# EAGLE design BaseBoard (EAGLE 6.5.0)
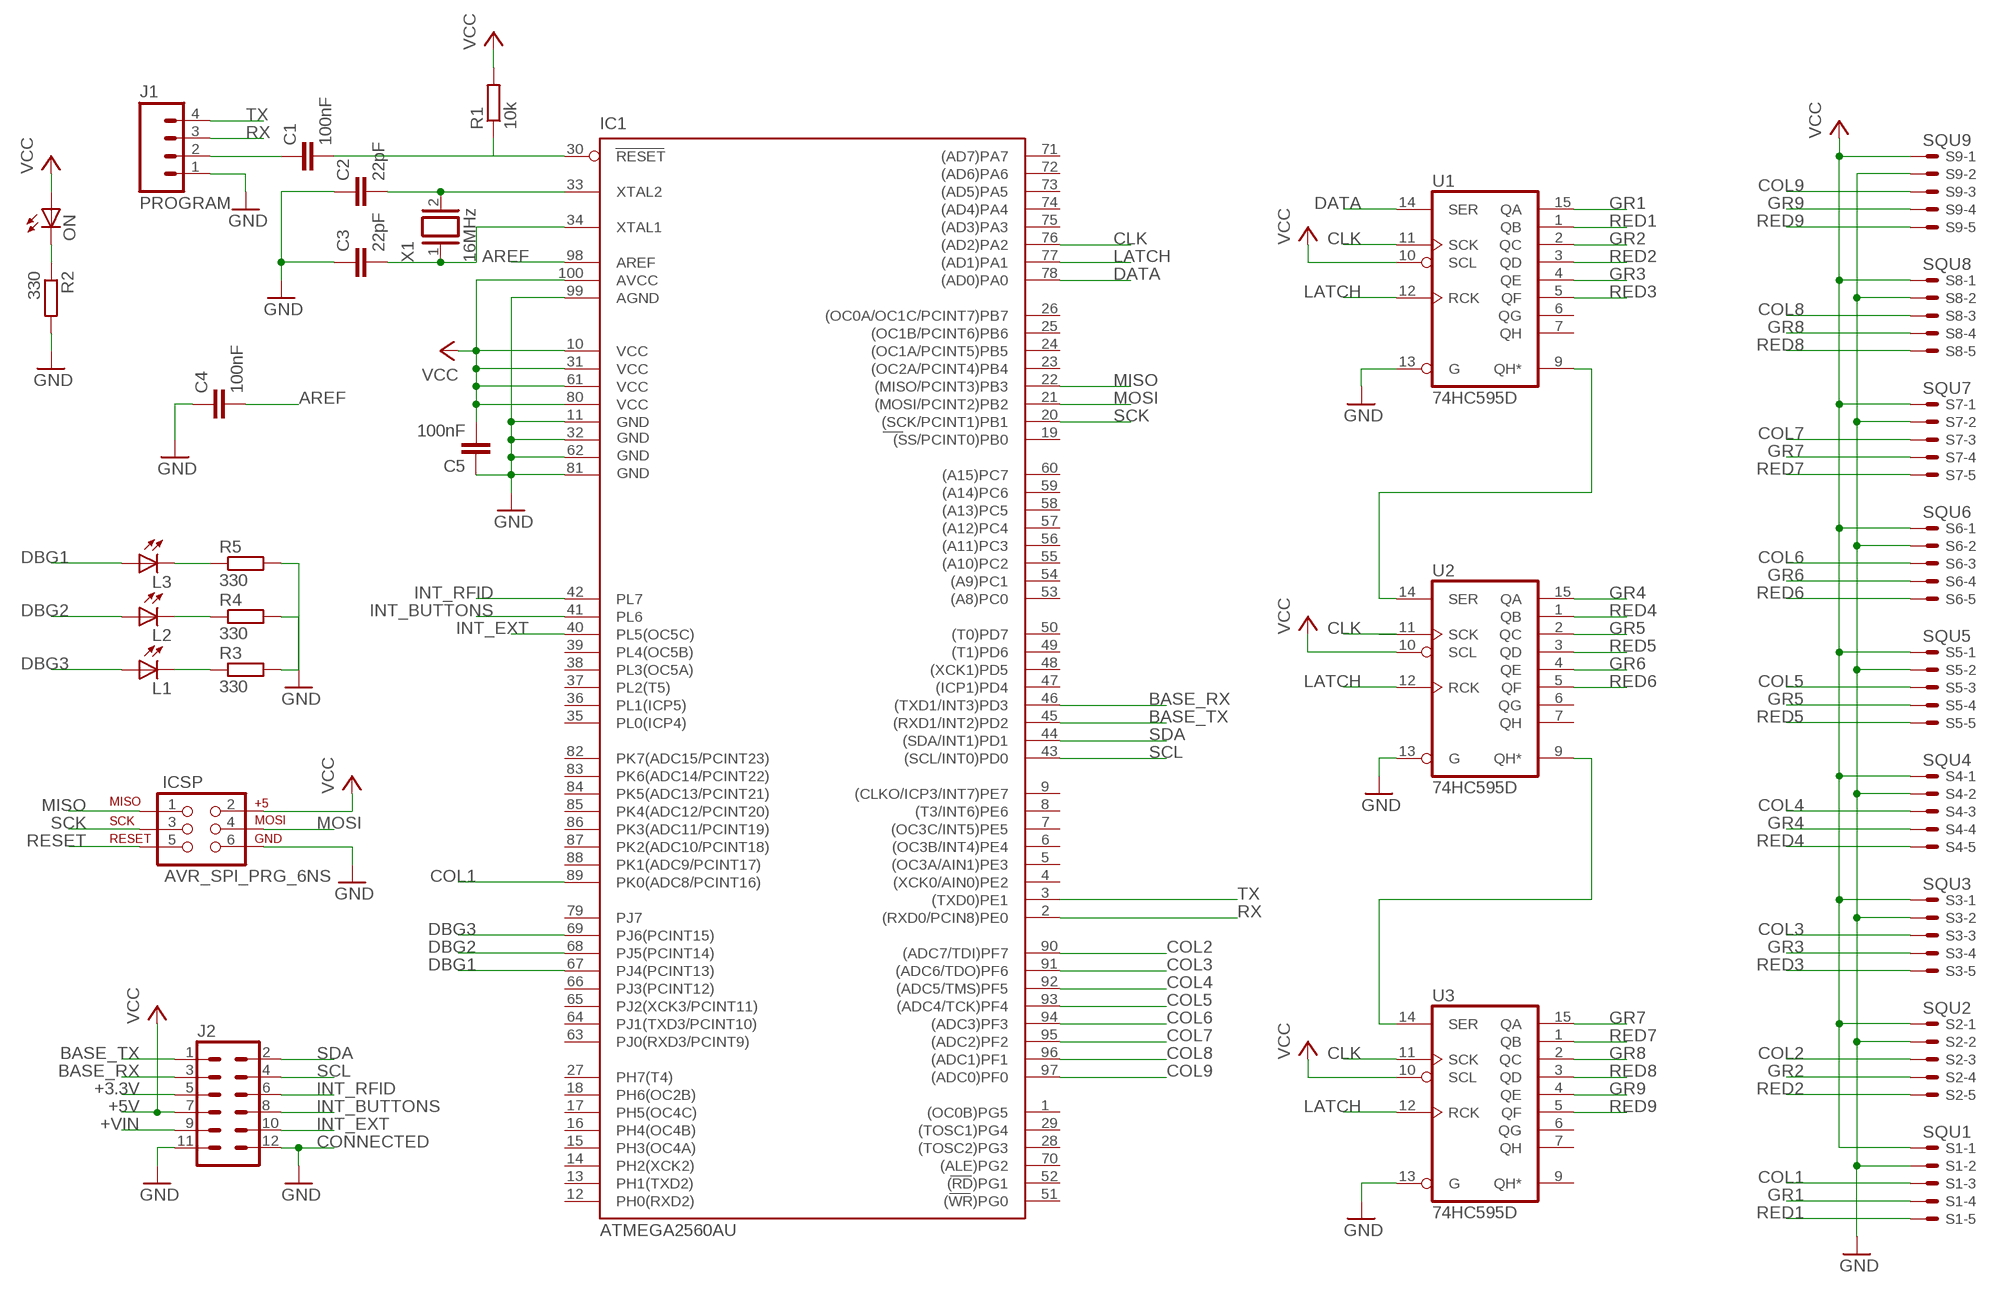
[diagram p0: schematic, sheet 1]

## Parts
C1  100nF  C-EUC0805  [C0805]
C2  22pF  C-EUC0805  [C0805]
C3  22pF  C-EUC0805  [C0805]
C4  100nF  C-EUC0805  [C0805]
C5  100nF  C-EUC0805  [C0805]
IC1  ATMEGA2560AU  [TQFP100]
ICSP  AVR_SPI_PRG_6NS  [2X3-NS]
J1  PROGRAM  M04PTH  [1X04]
J2  CON06X2-2MM  [CON06X2_2MM]
L1  LEDCHIP-LED0805  [CHIP-LED0805]
L2  LEDCHIP-LED0805  [CHIP-LED0805]
L3  LEDCHIP-LED0805  [CHIP-LED0805]
ON  LEDCHIP-LED0805  [CHIP-LED0805]
R1  10k  R-EU_R0805  [R0805]
R2  330  R-EU_R0805  [R0805]
R3  330  R-EU_R0805  [R0805]
R4  330  R-EU_R0805  [R0805]
R5  330  R-EU_R0805  [R0805]
S1  SQU1  53261-05  [53261-05]
S2  SQU2  53261-05  [53261-05]
S3  SQU3  53261-05  [53261-05]
S4  SQU4  53261-05  [53261-05]
S5  SQU5  53261-05  [53261-05]
S6  SQU6  53261-05  [53261-05]
S7  SQU7  53261-05  [53261-05]
S8  SQU8  53261-05  [53261-05]
S9  SQU9  53261-05  [53261-05]
U1  74HC595D  [SO16]
U2  74HC595D  [SO16]
U3  74HC595D  [SO16]
X1  16MHz  XTAL/S  [QS]

## Nets
+3.3V: J2.5
+VIN: J2.9
AREF: C4.2 IC1.98(AREF)
BASE_RX: IC1.46((TXD1/INT3)PD3) J2.3
BASE_TX: IC1.45((RXD1/INT2)PD2) J2.1
CLK: IC1.76((AD2)PA2) U1.11(SCK) U2.11(SCK) U3.11(SCK)
COL1: IC1.89(PK0(ADC8/PCINT16)) S1.3
COL2: IC1.90((ADC7/TDI)PF7) S2.3
COL3: IC1.91((ADC6/TDO)PF6) S3.3
COL4: IC1.92((ADC5/TMS)PF5) S4.3
COL5: IC1.93((ADC4/TCK)PF4) S5.3
COL6: IC1.94((ADC3)PF3) S6.3
COL7: IC1.95((ADC2)PF2) S7.3
COL8: IC1.96((ADC1)PF1) S8.3
COL9: IC1.97((ADC0)PF0) S9.3
DATA: IC1.78((AD0)PA0) U1.14(SER)
DBG1: IC1.67(PJ4(PCINT13)) L3.A
DBG2: IC1.68(PJ5(PCINT14)) L2.A
DBG3: IC1.69(PJ6(PCINT15)) L1.A
GND: C2.1 C3.1 C4.1 C5.1 IC1.11(GND) IC1.32(GND1) IC1.62(GND2) IC1.81(GND3) IC1.99(AGND) ICSP.6 J1.1 J2.11 J2.12 R2.2 R3.2 R4.2 R5.2 S1.2 S2.2 S3.2 S4.2 S5.2 S6.2 S7.2 S8.2 S9.2 U1.13(G) U2.13(G) U3.13(G)
GR1: S1.4 U1.15(QA)
GR2: S2.4 U1.2(QC)
GR3: S3.4 U1.4(QE)
GR4: S4.4 U2.15(QA)
GR5: S5.4 U2.2(QC)
GR6: S6.4 U2.4(QE)
GR7: S7.4 U3.15(QA)
GR8: S8.4 U3.2(QC)
GR9: S9.4 U3.4(QE)
INT_BUTTONS: IC1.41(PL6) J2.8
INT_EXT: IC1.40(PL5(OC5C)) J2.10
INT_RFID: IC1.42(PL7) J2.6
LATCH: IC1.77((AD1)PA1) U1.12(RCK) U2.12(RCK) U3.12(RCK)
MISO: IC1.22((MISO/PCINT3)PB3) ICSP.1
MOSI: IC1.21((MOSI/PCINT2)PB2) ICSP.4
N$1: C2.2 IC1.33(XTAL2) X1.2
N$2: C3.2 IC1.34(XTAL1) X1.1
N$3: L2.C R4.1
N$4: L1.C R3.1
N$5: C1.1 J1.2
N$6: U1.9(QH*) U2.14(SER)
N$7: U2.9(QH*) U3.14(SER)
N$8: ON.C R2.1
N$9: L3.C R5.1
RED1: S1.5 U1.1(QB)
RED2: S2.5 U1.3(QD)
RED3: S3.5 U1.5(QF)
RED4: S4.5 U2.1(QB)
RED5: S5.5 U2.3(QD)
RED6: S6.5 U2.5(QF)
RED7: S7.5 U3.1(QB)
RED8: S8.5 U3.3(QD)
RED9: S9.5 U3.5(QF)
RESET: C1.2 IC1.30(RESET) ICSP.5 R1.1
RX: IC1.2((RXD0/PCIN8)PE0) J1.3
SCK: IC1.20((SCK/PCINT1)PB1) ICSP.3
SCL: IC1.43((SCL/INT0)PD0) J2.4
SDA: IC1.44((SDA/INT1)PD1) J2.2
TX: IC1.3((TXD0)PE1) J1.4
VCC: C5.2 IC1.10(VCC) IC1.31(VCC1) IC1.61(VCC2) IC1.80(VCC3) IC1.100(AVCC) ICSP.2 J2.7 ON.A R1.2 S1.1 S2.1 S3.1 S4.1 S5.1 S6.1 S7.1 S8.1 S9.1 U1.10(SCL) U2.10(SCL) U3.10(SCL)
Unconnected: IC1.1((OC0B)PG5) IC1.4((XCK0/AIN0)PE2) IC1.5((OC3A/AIN1)PE3) IC1.6((OC3B/INT4)PE4) IC1.7((OC3C/INT5)PE5) IC1.8((T3/INT6)PE6) IC1.9((CLKO/ICP3/INT7)PE7) IC1.12(PH0(RXD2)) IC1.13(PH1(TXD2)) IC1.14(PH2(XCK2)) IC1.15(PH3(OC4A)) IC1.16(PH4(OC4B)) IC1.17(PH5(OC4C)) IC1.18(PH6(OC2B)) IC1.19((SS/PCINT0)PB0) IC1.23((OC2A/PCINT4)PB4) IC1.24((OC1A/PCINT5)PB5) IC1.25((OC1B/PCINT6)PB6) IC1.26((OC0A/OC1C/PCINT7)PB7) IC1.27(PH7(T4)) IC1.28((TOSC2)PG3) IC1.29((TOSC1)PG4) IC1.35(PL0(ICP4)) IC1.36(PL1(ICP5)) IC1.37(PL2(T5)) IC1.38(PL3(OC5A)) IC1.39(PL4(OC5B)) IC1.47((ICP1)PD4) IC1.48((XCK1)PD5) IC1.49((T1)PD6) IC1.50((T0)PD7) IC1.51((WR)PG0) IC1.52((RD)PG1) IC1.53((A8)PC0) IC1.54((A9)PC1) IC1.55((A10)PC2) IC1.56((A11)PC3) IC1.57((A12)PC4) IC1.58((A13)PC5) IC1.59((A14)PC6) IC1.60((A15)PC7) IC1.63(PJ0(RXD3/PCINT9)) IC1.64(PJ1(TXD3/PCINT10)) IC1.65(PJ2(XCK3/PCINT11)) IC1.66(PJ3(PCINT12)) IC1.70((ALE)PG2) IC1.71((AD7)PA7) IC1.72((AD6)PA6) IC1.73((AD5)PA5) IC1.74((AD4)PA4) IC1.75((AD3)PA3) IC1.79(PJ7) IC1.82(PK7(ADC15/PCINT23)) IC1.83(PK6(ADC14/PCINT22)) IC1.84(PK5(ADC13/PCINT21)) IC1.85(PK4(ADC12/PCINT20)) IC1.86(PK3(ADC11/PCINT19)) IC1.87(PK2(ADC10/PCINT18)) IC1.88(PK1(ADC9/PCINT17)) U1.6(QG) U1.7(QH) U2.6(QG) U2.7(QH) U3.6(QG) U3.7(QH) U3.9(QH*)

## Notes on the sheet
- +5V
- CONNECTED

## Power pins joined to a net without a drawn wire
GND: U1.8(GND) U2.8(GND) U3.8(GND)
VCC: U1.16(VCC) U2.16(VCC) U3.16(VCC)

## Library data of the parts
C1-C5 = resistor:C-EU: CAPACITOR, European symbol
IC1 = SparkFun-DigitalIC:ATMEGA2560: Atmel 100-pin 8-bit uC 64/128/256 Kbytes FLASH 4 Kbytes EEPROM 8 Kbytes SRAM 86 General Purpose I/O pins 12-channels16-bit PWM 4 x Serial USARTs 16-channels 10-bit A/D
ICSP = SparkFun-Connectors:AVR_SPI_PRG_6: AVR ISP 6 Pin This is the reduced ISP connector for AVR programming. Common on Arduino. This footprint will take up less PCB space and can be used with a 10-pin to 6-pin adapter such as SKU: BOB-08508
J1 = SparkFun-Connectors:M04: Header 4 Standard 4-pin 0.1" header. Use with straight break away headers (SKU : PRT-00116), right angle break away headers (PRT-00553), swiss pins (PRT-00743), machine pins (PRT-00117), and female headers (PRT-00115). Molex polarized connector foot print use with SKU : PRT-08231 with associated crimp pins and housings. 1MM SMD Version SKU: PRT-10208
J2 = Connectors:CON06X2-2MM
L1-L3 ON = led:LED: LED OSRAM: - CHIPLED LG R971, LG N971, LY N971, LG Q971, LY Q971, LO R971, LY R971 LH N974, LH R974 LS Q976, LO Q976, LY Q976 LO Q996 - Hyper CHIPLED LW Q18S LB Q993, LB Q99A, LB R99A - SideLED LS A670, LO A670, LY A670, LG A670, LP A670 LB A673, LV A673, LT A673, LW A673 LH A674 LY A675 LS A676, LA A676, LO A676, LY A676, LW A676 LS A679, LY A679, LG A679 - Hyper Micro SIDELED® LS Y876, LA Y876, LO Y876, LY Y876 LT Y87S - SmartLED LW L88C, LW L88S LB L89C, LB L89S, LG L890 LS L89K, LO L89K, LY L89K LS L896, LA L896, LO L896, LY L896 - TOPLED LS T670, LO T670, LY T670, LG T670, LP T670 LSG T670, LSP T670, LSY T670, LOP T670, LYG T670 LG T671, LOG T671, LSG T671 LB T673, LV T673, LT T673, LW T673 LH T674 LS T676, LA T676, LO T676, LY T676, LB T676, LH T676, LSB T676, LW T676 LB T67C, LV T67C, LT T67C, LS T67K, LO T67K, LY T67K, LW E67C LS E67B, LA E67B, LO E67B, LY E67B, LB E67C, LV E67C, LT E67C LW T67C LS T679, LY T679, LG T679 LS T770, LO T770, LY T770, LG T770, LP T770 LB T773, LV T773, LT T773, LW T773 LH T774 LS E675, LA E675, LY E675, LS T675 LS T776, LA T776, LO T776, LY T776, LB T776 LHGB T686 LT T68C, LB T68C - Hyper Mini TOPLED® LB M676 - Mini TOPLED Santana® LG M470 LS M47K, LO M47K, LY M47K Source: http://www.osram.convergy.de LUXEON: - LUMILED® LXK2-PW12-R00, LXK2-PW12-S00, LXK2-PW14-U00, LXK2-PW14-V00 LXK2-PM12-R00, LXK2-PM12-S00, LXK2-PM14-U00 LXK2-PE12-Q00, LXK2-PE12-R00, LXK2-PE12-S00, LXK2-PE14-T00, LXK2-PE14-U00 LXK2-PB12-K00, LXK2-PB12-L00, LXK2-PB12-M00, LXK2-PB14-N00, LXK2-PB14-P00, LXK2-PB14-Q00 LXK2-PR12-L00, LXK2-PR12-M00, LXK2-PR14-Q00, LXK2-PR14-R00 LXK2-PD12-Q00, LXK2-PD12-R00, LXK2-PD12-S00 LXK2-PH12-R00, LXK2-PH12-S00 LXK2-PL12-P00, LXK2-PL12-Q00, LXK2-PL12-R00 Source: www.luxeon.com KINGBRIGHT: KA-3528ASYC Source: www.kingbright.com
R1-R5 = resistor:R-EU_: RESISTOR, European symbol
S1-S9 = con-molex:53?-05: CONNECTOR wire to board 1.25 mm (.049 inch) pitch header; OC_FARNELL: 1433644; OC_NEWARK: unknown
U1-U3 = 74xx-eu:74*595: 8-bit SHIFT REGISTER, output latch
X1 = special:XTAL/S: CRYSTAL

## Board
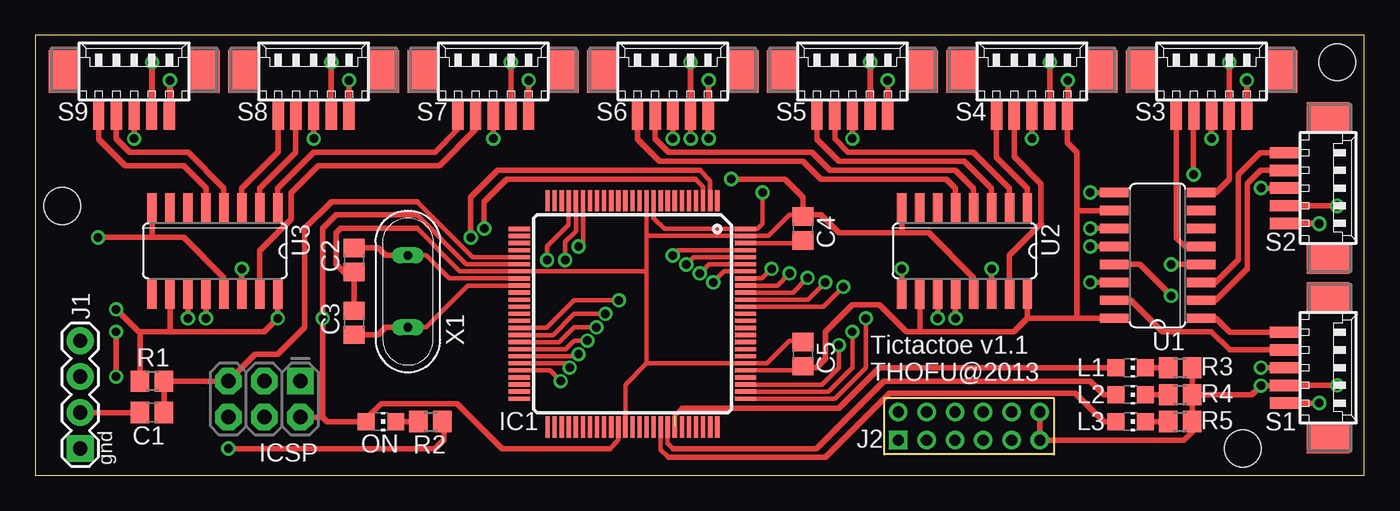
[diagram p1: board, top side]
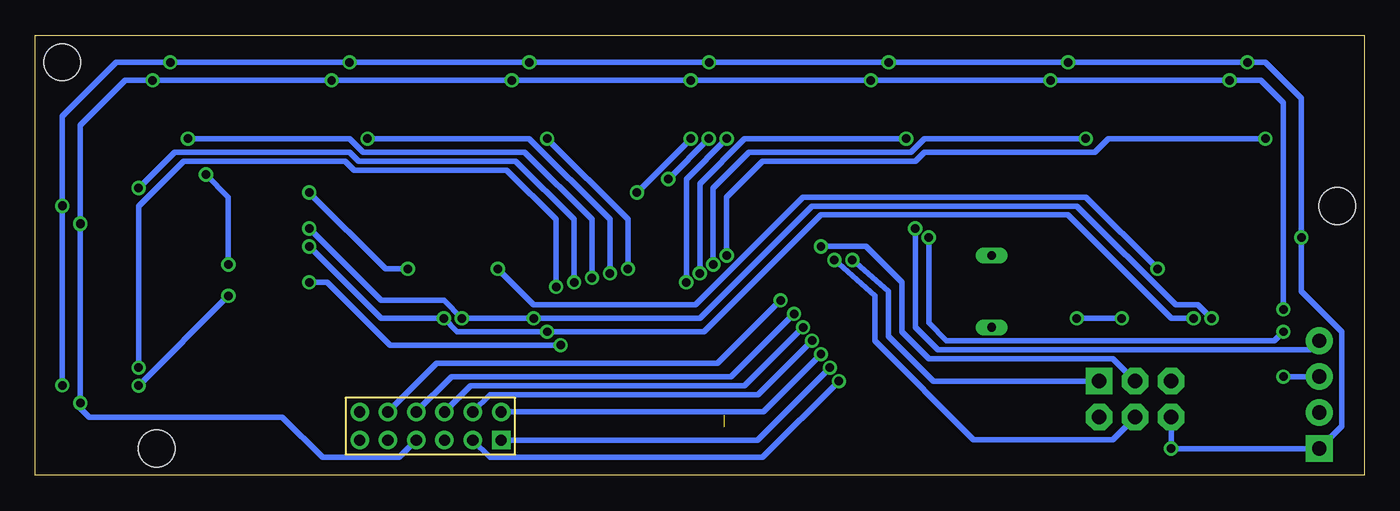
[diagram p2: board, bottom side, seen from below]

Size 93.98 x 31.11 mm. Coordinates in mm from the lower left corner, seen from the top.
Outline: 0,0 93.98,0 93.98,31.11 0,31.11 0,0
Copper layers (1*16): Top 0.035mm / dielectric 1.5mm / Bottom 0.035mm
Design rules "default": minimum track width 10mil, minimum drill 24mil, track to track 8mil, track to pad 8mil, pad to pad 8mil, via to via 8mil, smd to smd 8mil, copper to edge 40mil, drill to drill 8mil, minimum pad ring 10mil, minimum via ring 8mil, stop-mask expansion 4mil, vias tented up to drill 0mil, thermal gap 10mil
Holes 2.6 mm at 92.08,29.21 1.91,19.05 85.41,1.91

### Footprints (pad centres in the part's own frame; a part is rotated, then mirrored left to right if it is on the bottom)
C0805 = smd 1.3 x 1.5: 1 -0.85,0; 2 0.85,0
TQFP100 = smd 1.5 x 0.3: 1 -8,6; 2 -8,5.5; 3 -8,5; 4 -8,4.5; 5 -8,4; 6 -8,3.5; 7 -8,3; 8 -8,2.5; 9 -8,2; 10 -8,1.5; 11 -8,1; 12 -8,0.5; 13 -8,0; 14 -8,-0.5; 15 -8,-1; 16 -8,-1.5; 17 -8,-2; 18 -8,-2.5; 19 -8,-3; 20 -8,-3.5; 21 -8,-4; 22 -8,-4.5; 23 -8,-5; 24 -8,-5.5; 25 -8,-6; 51 8,-6; 52 8,-5.5; 53 8,-5; 54 8,-4.5; 55 8,-4; 56 8,-3.5; 57 8,-3; 58 8,-2.5; 59 8,-2; 60 8,-1.5; 61 8,-1; 62 8,-0.5; 63 8,0; 64 8,0.5; 65 8,1; 66 8,1.5; 67 8,2; 68 8,2.5; 69 8,3; 70 8,3.5; 71 8,4; 72 8,4.5; 73 8,5; 74 8,5.5; 75 8,6 | smd 0.3 x 1.5: 26 -6,-8; 27 -5.5,-8; 28 -5,-8; 29 -4.5,-8; 30 -4,-8; 31 -3.5,-8; 32 -3,-8; 33 -2.5,-8; 34 -2,-8; 35 -1.5,-8; 36 -1,-8; 37 -0.5,-8; 38 0,-8; 39 0.5,-8; 40 1,-8; 41 1.5,-8; 42 2,-8; 43 2.5,-8; 44 3,-8; 45 3.5,-8; 46 4,-8; 47 4.5,-8; 48 5,-8; 49 5.5,-8; 50 6,-8; 76 6,8; 77 5.5,8; 78 5,8; 79 4.5,8; 80 4,8; 81 3.5,8; 82 3,8; 83 2.5,8; 84 2,8; 85 1.5,8; 86 1,8; 87 0.5,8; 88 0,8; 89 -0.5,8; 90 -1,8; 91 -1.5,8; 92 -2,8; 93 -2.5,8; 94 -3,8; 95 -3.5,8; 96 -4,8; 97 -4.5,8; 98 -5,8; 99 -5.5,8; 100 -6,8
2X3-NS = drill 1.016 pad 1.88 square: 1 -2.54,-1.27 | drill 1.016 pad 1.88 octagon: 2 -2.54,1.27; 3 0,-1.27; 4 0,1.27; 5 2.54,-1.27; 6 2.54,1.27
1X04 = drill 1.016 pad 1.88 square: 1 0,0 | drill 1.016 pad 1.88: 2 2.54,0; 3 5.08,0; 4 7.62,0
CON06X2_2MM = drill 0.8 square: 1 -5,-1 | drill 0.8: 2 -5,1; 3 -3,-1; 4 -3,1; 5 -1,-1; 6 -1,1; 7 1,-1; 8 1,1; 9 3,-1; 10 3,1; 11 5,-1; 12 5,1
CHIP-LED0805 = smd 1.2 x 1.2: A 0,-1.05; C 0,1.05
R0805 = smd 1.3 x 1.5: 1 -0.85,0; 2 0.85,0
53261-05 = smd 0.8 x 2: 1 2.5,-2.5; 2 1.25,-2.5; 3 0,-2.5; 4 -1.25,-2.5; 5 -2.5,-2.5 | smd 2.1 x 3: S1 5,0.625; S2 -5,0.625
SO16 = smd 0.66 x 2.032: 1 -4.445,-3.073; 2 -3.175,-3.073; 3 -1.905,-3.073; 4 -0.635,-3.073; 5 0.635,-3.073; 6 1.905,-3.073; 7 3.175,-3.073; 8 4.445,-3.073; 9 4.445,3.073; 10 3.175,3.073; 11 1.905,3.073; 12 0.635,3.073; 13 -0.635,3.073; 14 -1.905,3.073; 15 -3.175,3.073; 16 -4.445,3.073
QS = drill 0.61 long: 1 -2.54,0; 2 2.54,0

### Placement (x,y rotation side)
C1  8.26,4.45 0 top
C2  22.54,15.24 90 top
C3  22.54,10.79 270 top
C4  54.29,17.46 270 top
C5  54.29,8.57 270 top
IC1  42.23,11.43 270 top
ICSP  16.19,5.4 180 top
J1  3.17,1.91 90 top
J2  66.04,3.49 0 top
L1  77.47,7.62 270 top
L2  77.47,5.71 270 top
L3  77.47,3.81 270 top
ON  24.45,3.81 270 top
R1  8.26,6.67 180 top
R2  27.94,3.81 0 top
R3  80.96,7.62 0 top
R4  80.96,5.71 0 top
R5  80.96,3.81 0 top
S1  90.81,7.62 270 top
S2  90.81,20.32 270 top
S3  83.19,27.94 0 top
S4  70.48,27.94 0 top
S5  57.78,27.94 0 top
S6  45.09,27.94 0 top
S7  32.38,27.94 0 top
S8  19.68,27.94 0 top
S9  6.99,27.94 0 top
U1  79.38,15.56 90 top
U2  65.72,15.88 180 top
U3  12.7,15.88 180 top
X1  26.35,13.02 90 top

### Tracks (layer width: path | path; a pad name or v marks a point on that pad's centre or on a via)
AREF
  Top 0.305: IC1.98 54.11,16.43 C4.2
  Top 0.406: 54.16,16.43 C4.2
BASE_RX  (via drill 0.6)
  Top 0.305: v37.15,6.67 36.38,7.43 IC1.46
  Bottom 0.406: v37.15,6.67 42.55,1.27 59.37,1.27 61.82,1.27 J2.3
BASE_TX  (via drill 0.6)
  Top 0.305: IC1.45 37.47,7.93 v37.78,7.62
  Bottom 0.406: v37.78,7.62 42.91,2.49 J2.1
CLK  (via drill 0.6)
  Top 0.305: IC1.76 56.55,5.43 58.74,7.62 v58.74,11.11
  Top 0.406: U3.11 v10.79,11.11 | U2.11 v63.82,11.11 | U1.11 v74.61,17.46
  Bottom 0.406: v74.61,17.46 69.53,12.38 65.09,12.38 v63.82,11.11 v58.74,11.11 46.99,11.11 39.05,19.05 20.32,19.05 13.34,12.06 11.75,12.06 v10.79,11.11
COL1  (via drill 0.6)
  Top 0.305: IC1.89 55.74,11.93 v57.15,13.34
  Top 0.406: S1.3 v86.68,7.62
  Bottom 0.406: v57.15,13.34 57.15,18.1 60.64,21.59 71.44,21.59 72.07,22.23 83.5,22.23 86.68,19.05 v86.68,7.62
COL2  (via drill 0.6)
  Top 0.305: IC1.90 54.66,12.43 v55.88,13.65
  Top 0.406: S2.3 v86.68,20.32
  Bottom 0.406: v55.88,13.65 55.88,18.1 60.01,22.23 71.12,22.23 71.75,22.86 84.14,22.86 v86.68,20.32
COL3  (via drill 0.6)
  Top 0.305: IC1.91 53.57,12.93 v54.61,13.97
  Top 0.406: S3.3 v83.19,23.81
  Bottom 0.406: v54.61,13.97 54.61,18.1 59.37,22.86 70.8,22.86 71.75,23.81 v83.19,23.81
COL4  (via drill 0.6)
  Top 0.305: IC1.92 52.48,13.43 v53.34,14.29
  Top 0.406: S4.3 v70.48,23.81
  Bottom 0.406: v53.34,14.29 53.34,18.1 59.05,23.81 v70.48,23.81
COL5  (via drill 0.6)
  Top 0.305: IC1.93 51.4,13.93 v52.07,14.61
  Top 0.406: S5.3 v57.78,23.81
  Bottom 0.406: v52.07,14.61 52.07,18.1 v57.78,23.81
COL6  (via drill 0.6)
  Top 0.305: IC1.94 48.72,14.43 v47.94,13.65
  Top 0.406: S6.3 v45.09,23.81
  Bottom 0.406: v47.94,13.65 47.94,20.95 v45.09,23.81
COL7  (via drill 0.6)
  Top 0.305: IC1.95 47.63,14.93 v46.99,14.29
  Top 0.406: S7.3 v32.38,23.81
  Bottom 0.406: v46.99,14.29 46.99,20.64 43.81,23.81 v32.38,23.81
COL8  (via drill 0.6)
  Top 0.305: IC1.96 46.55,15.43 v46.04,14.92
  Top 0.406: S8.3 v19.68,23.81
  Bottom 0.406: v46.04,14.92 46.04,20.32 43.5,22.86 32.07,22.86 31.11,23.81 v19.68,23.81
COL9  (via drill 0.6)
  Top 0.305: IC1.97 45.46,15.93 v45.09,15.56
  Top 0.406: S9.3 v6.99,23.81
  Bottom 0.406: v45.09,15.56 45.09,19.68 42.55,22.23 31.75,22.23 31.11,22.86 19.05,22.86 18.1,23.81 v6.99,23.81
DATA  (via drill 0.6)
  Top 0.305: IC1.78 55.64,6.43 56.83,7.62 v56.83,9.21
  Top 0.406: U1.14 v74.61,13.65
  Bottom 0.406: v74.61,13.65 73.34,13.65 68.9,9.21 v56.83,9.21
DBG1
  Top 0.305: IC1.67 44.23,1.81 44.77,1.27
  Top 0.406: 44.77,1.27 55.88,1.27 60.42,5.81 73.56,5.81 75.56,3.81 L3.A
DBG2
  Top 0.305: IC1.68 44.73,2.26 45.09,1.91
  Top 0.406: 45.09,1.91 55.24,1.91 60.01,6.67 74.61,6.67 75.56,5.71 L2.A
DBG3  (1 unrouted)
  Top 0.305: 45.23,4.27 45.72,4.76
  Top 0.406: L1.A 59.69,7.62 56.83,4.76 45.72,4.76
GND  (via drill 0.6)
  Top 0.305: C5.1 54.19,9.53 53.34,9.53 51.74,7.93 IC1.81 43.23,7.93 | IC1.11 43.23,16.93 | 43.23,16.93 IC1.99 51.85,16.93 53.34,18.41 54.19,18.41 C4.1 | 43.23,16.93 43.23,14.43 | 43.23,14.43 43.23,7.93 | 43.23,14.43 IC1.32 30.02,14.43 26.99,17.46 | IC1.62 41.73,6.43 43.23,7.93
  Top 0.406: S4.2 71.75,25.44 v71.75,29.21 | v46.34,29.21 S6.2 46.34,23.83 v46.35,23.81 | S7.2 v33.63,29.21 | S8.2 v20.93,29.21 | v84.44,29.21 S3.2 84.45,25.42 84.45,20.95 83.5,20 U1.8 | v92.08,19.07 S2.2 92.06,19.07 v92.08,19.05 | v92.08,6.37 S1.2 88.28,6.35 v86.68,6.35 86.04,5.71 R4.2 | 61.28,17.14 63.18,17.14 66.36,13.97 U2.13 | U2.8 61.28,17.14 | 61.28,17.14 56.83,17.14 55.56,18.41 54.4,18.41 C4.1 54.29,19.68 53.02,20.95 v49.21,20.95 | U3.8 8.26,16.83 | 8.26,16.83 v4.45,16.83 | 8.26,16.83 10.48,16.83 13.34,13.97 U3.13 | U1.13 78.11,14.92 v80.33,12.7 | R4.2 R5.2 81.81,3.07 81.23,2.49 J2.11 J2.12 | C2.1 22.54,14.29 | C3.1 22.54,14.29 | 22.54,14.29 21.91,14.29 21.27,14.92 21.27,17.14 21.59,17.46 26.99,17.46 | v13.65,1.91 28.26,1.91 28.89,2.54 28.89,3.71 R2.2 | R3.2 R4.2 | S9.2 8.26,25.44 v8.26,29.21 8.23,29.19 S9.2 | v59.05,29.21 v59.03,29.21 S5.2 59.05,25.44 v59.05,29.21
  Bottom 0.406: v59.05,29.21 v71.75,29.21 v84.44,29.21 88.27,29.21 92.08,25.4 v92.08,19.05 | v59.03,29.21 v46.34,29.21 v33.63,29.21 v20.93,29.21 v8.26,29.21 6.99,29.21 4.45,26.67 v4.45,16.83 4.45,13.02 1.59,10.16 1.59,3.49 J1.1 v13.65,1.91 ICSP.6 | v92.08,19.07 v92.08,19.05 | v92.08,19.05 v92.08,6.37 | v46.35,23.81 v49.21,20.95 | v80.33,12.7 v86.68,6.35
GR1
  Top 0.406: S1.4 84.47,8.87 83.19,10.16 79.69,10.16 77.47,12.38 U1.15
GR2
  Top 0.406: S2.4 86.66,21.57 85.72,20.64 85.72,14.61 83.5,12.38 U1.2
GR3  (via drill 0.6)
  Top 0.406: S3.4 81.92,25.44 v81.92,21.27 | U1.4 v80.33,14.92
  Bottom 0.406: v81.92,21.27 80.33,19.68 v80.33,14.92
GR4
  Top 0.406: U2.15 68.9,15.56 71.12,17.78 | 71.12,17.78 71.14,17.8 | S4.4 69.23,22.52 71.12,20.64 71.12,17.78
GR5
  Top 0.406: S5.4 56.53,23.79 57.47,22.86 66.36,22.86 68.9,20.32 U2.2
GR6
  Top 0.406: S6.4 43.84,23.79 44.77,22.86 54.93,22.86 56.2,21.59 65.09,21.59 66.36,20.32 U2.4
GR7
  Top 0.406: U3.15 15.88,15.88 18.1,18.1 18.1,20 20,21.91 28.57,21.91 31.14,24.47 S7.4
GR8
  Top 0.406: U3.2 15.88,20.32 18.41,22.86 18.41,25.42 S8.4
GR9
  Top 0.406: S9.4 5.74,23.79 6.67,22.86 10.79,22.86 13.34,20.32 U3.4
INT_BUTTONS  (via drill 0.6)
  Top 0.305: IC1.41 36.6,9.93 38.1,11.43 v40.32,11.43
  Bottom 0.406: v40.32,11.43 44.77,6.99 60.33,6.99 64.55,6.99 J2.8
INT_EXT  (via drill 0.6)
  Top 0.305: IC1.40 36.15,10.43 38.1,12.38 v41.27,12.38
  Bottom 0.406: v41.27,12.38 45.72,7.94 65.59,7.94 J2.10
INT_RFID  (via drill 0.6)
  Top 0.305: IC1.42 37.05,9.43 38.1,10.48 v39.69,10.48
  Bottom 0.406: v39.69,10.48 43.81,6.35 61.91,6.35 63.18,6.35 J2.6
LATCH  (via drill 0.6)
  Top 0.305: IC1.77 56.09,5.93 57.78,7.62 v57.78,10.16
  Top 0.406: U3.12 v12.06,11.11 | U2.12 v65.09,11.11 | U1.12 v74.61,16.19
  Bottom 0.406: v74.61,16.19 69.53,11.11 v65.09,11.11 64.14,10.16 v57.78,10.16 46.67,10.16 38.42,18.41 20.95,18.41 13.65,11.11 v12.06,11.11
MISO  (via drill 0.6)
  Top 0.305: IC1.22 37.73,17.73 36.2,16.19 v36.2,15.24
  Bottom 0.406: ICSP.1 30.48,6.67 33.66,9.84 33.66,13.02 v36.2,15.24
MOSI  (via drill 0.6)
  Top 0.305: IC1.21 38.23,17.27 37.47,16.51 v37.47,15.24
  Bottom 0.406: ICSP.4 17.78,2.54 27.62,2.54 34.61,9.53 34.61,12.7 v37.47,15.24
N$1
  Top 0.305: IC1.33 29.25,13.93 27.62,15.56 X1.2
  Top 0.406: X1.2 24.77,15.56 24.23,16.09 C2.2
N$2
  Top 0.305: IC1.34 30.57,13.43 27.62,10.48 X1.1
  Top 0.406: X1.1 24.77,10.48 24.23,9.95 C3.2
N$3
  Top 0.406: L2.C R4.1
N$4
  Top 0.406: L1.C R3.1
N$5
  Top 0.406: C1.1 J1.2
N$6  (via drill 0.6)
  Top 0.406: U1.9 v74.61,20 | U2.14 v67.63,14.61
  Bottom 0.406: v74.61,20 69.22,14.61 v67.63,14.61
N$7  (via drill 0.6)
  Top 0.406: U2.9 v61.28,14.61 | v14.61,14.61 U3.14
  Bottom 0.406: v61.28,14.61 58.74,12.06 47.31,12.06 39.69,19.68 19.68,19.68 v14.61,14.61
N$8
  Top 0.406: ON.C R2.1
N$9
  Top 0.406: L3.C R5.1
RED1
  Top 0.406: S1.5 84.5,10.12 83.5,11.11 U1.1
RED2
  Top 0.406: S2.5 86.64,22.82 85.09,21.27 85.09,15.24 83.5,13.65 U1.3
RED3
  Top 0.406: U1.5 81.28,16.19 80.69,16.79 S3.5
RED4
  Top 0.406: S4.5 67.98,22.5 70.17,20.32 U2.1
RED5
  Top 0.406: S5.5 55.28,23.77 56.83,22.23 65.72,22.23 67.63,20.32 U2.3
RED6
  Top 0.406: S6.5 42.59,23.77 44.13,22.23 54.29,22.23 55.56,20.95 64.45,20.95 65.09,20.32 U2.5
RED7
  Top 0.406: U3.1 17.14,20.32 19.68,22.86 28.26,22.86 29.84,24.45 29.84,25.4 S7.5
RED8
  Top 0.406: U3.3 14.61,20.32 17.18,22.9 S8.5
RED9
  Top 0.406: S9.5 4.49,23.77 6.35,21.91 10.48,21.91 12.06,20.32 U3.5
RESET
  Top 0.305: IC1.30 30.93,15.43 26.99,19.37
  Top 0.406: 26.99,19.37 20.95,19.37 19.05,17.46 19.05,10.48 17.14,8.57 15.56,8.57 ICSP.5 R1.1 C1.2
RX  (via drill 0.6)
  Top 0.305: IC1.2 47.73,20.85 46.99,21.59
  Top 0.406: 46.99,21.59 32.7,21.59 30.8,19.68 v30.8,16.83 | v5.71,6.99 v5.71,10.16
  Bottom 0.406: v30.8,16.83 30.8,10.79 29.53,9.53 6.35,9.53 v5.71,10.16 | J1.3 v5.71,6.99
SCK  (via drill 0.6)
  Top 0.305: IC1.20 38.73,16.5 v38.42,16.19
  Bottom 0.406: ICSP.3 17.78,8.26 30.8,8.26 32.7,10.16 32.7,13.65 35.24,16.19 v38.42,16.19
SCL  (via drill 0.6)
  Top 0.305: IC1.43 37.51,8.93 38.1,9.53 v39.05,9.53
  Bottom 0.406: v39.05,9.53 42.86,5.71 58.1,5.71 61.82,5.71 J2.4
SDA  (via drill 0.6)
  Top 0.305: IC1.44 38.27,8.43 v38.42,8.57
  Bottom 0.406: v38.42,8.57 42.5,4.49 J2.2
TX  (via drill 0.6)
  Top 0.305: IC1.3 47.23,20.4 46.67,20.95
  Top 0.406: 46.67,20.95 33.34,20.95 31.75,19.37 v31.75,17.46
  Bottom 0.406: v31.75,17.46 31.75,10.48 30.16,8.89 3.81,8.89 J1.4
VCC  (via drill 0.6)
  Top 0.305: IC1.80 54,7.43 C5.2 | IC1.10 43.73,18.18 44.48,17.43 IC1.100 51.09,17.43 51.44,17.78 v51.44,20 | IC1.31 30.47,14.93 26.99,18.41 | IC1.61 41.23,2.49 40.64,1.91
  Top 0.406: v73.03,27.94 73.03,25.44 S4.1 72.98,23.54 73.66,22.86 73.66,18.73 | v60.28,27.94 S5.1 | v47.62,27.94 47.62,25.44 S6.1 47.59,23.85 v47.62,23.81 | S7.1 v34.88,27.94 | S8.1 v22.18,27.94 | S3.1 v85.69,27.94 | v90.81,17.82 S2.1 88.31,17.78 v90.81,17.78 | v90.81,5.12 S1.1 | 9.53,10.16 U3.10 | 62.55,10.16 U2.10 62.55,13.34 | 70.17,11.11 U2.16 | U1.16 73.66,11.11 | 73.66,11.11 70.17,11.11 | U1.10 73.66,18.73 | 73.66,18.73 73.66,11.11 | 62.55,10.16 61.59,10.16 59.69,12.06 57.78,12.06 55.88,10.16 55.88,8.26 55.24,7.62 54.4,7.62 C5.2 | 20.32,4.13 ICSP.2 | 9.53,10.16 16.19,10.16 v17.14,11.11 U3.16 | 26.99,18.41 21.27,18.41 20.32,17.46 v20.32,11.11 20.32,4.13 | 40.64,1.91 33.02,1.91 29.84,5.08 24.45,5.08 23.4,4.03 ON.A 20.64,3.81 20.32,4.13 | 62.55,10.16 69.22,10.16 70.17,11.11 | R1.2 7.41,10.06 | 7.41,10.06 7.41,10.16 9.53,10.16 | 7.41,10.06 v5.71,11.75 | S9.1 9.53,25.44 v9.53,27.94 9.48,27.9 S9.1
  Bottom 0.406: v90.81,17.82 v90.81,17.78 | v90.81,17.78 v90.81,5.12 90.81,4.76 90.17,4.13 76.52,4.13 73.66,1.27 68.26,1.27 J2.7 | v90.81,17.78 90.81,24.77 87.63,27.94 v85.69,27.94 v73.03,27.94 v60.28,27.94 v47.62,27.94 v34.88,27.94 v22.18,27.94 v9.53,27.94 7.3,27.94 5.71,26.35 v5.71,11.75 | v47.62,23.81 v51.44,20 | v17.14,11.11 v20.32,11.11

### Text on the board
tNames: Tictactoe v1.1 / THOFU@2013 | gnd